# Altium schematic sheet F405.SchDoc
size A0
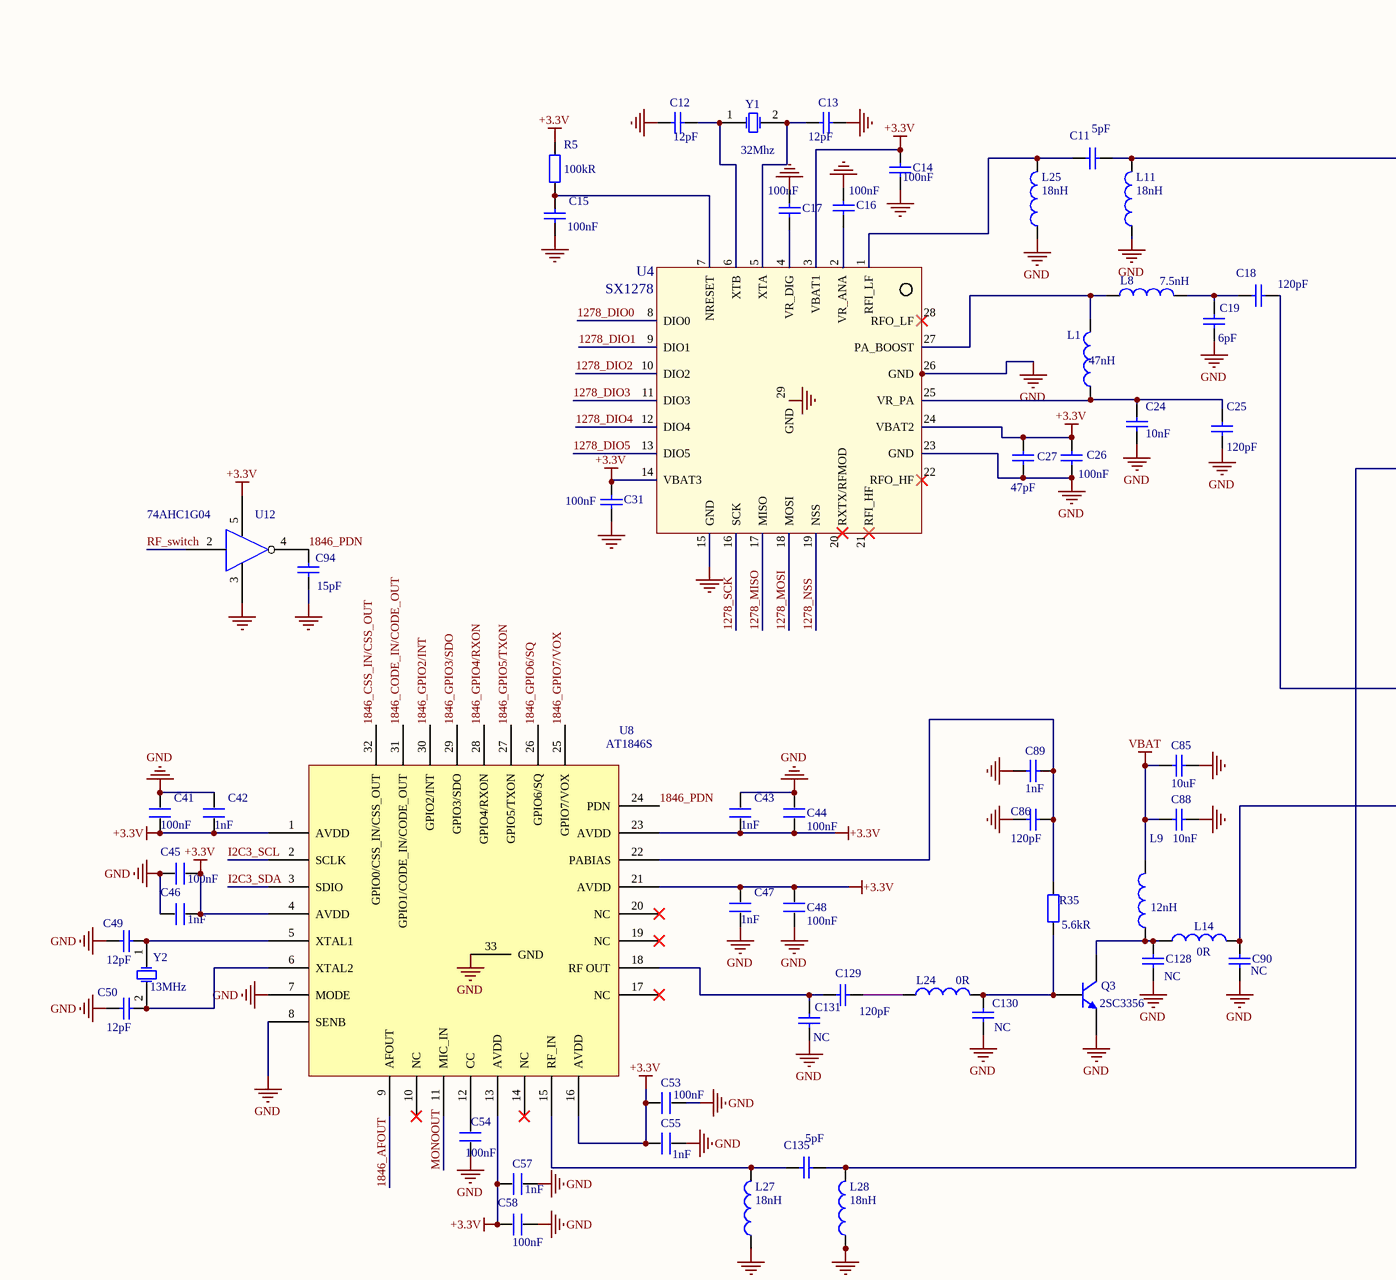
[diagram p0: F405.SchDoc, top left]
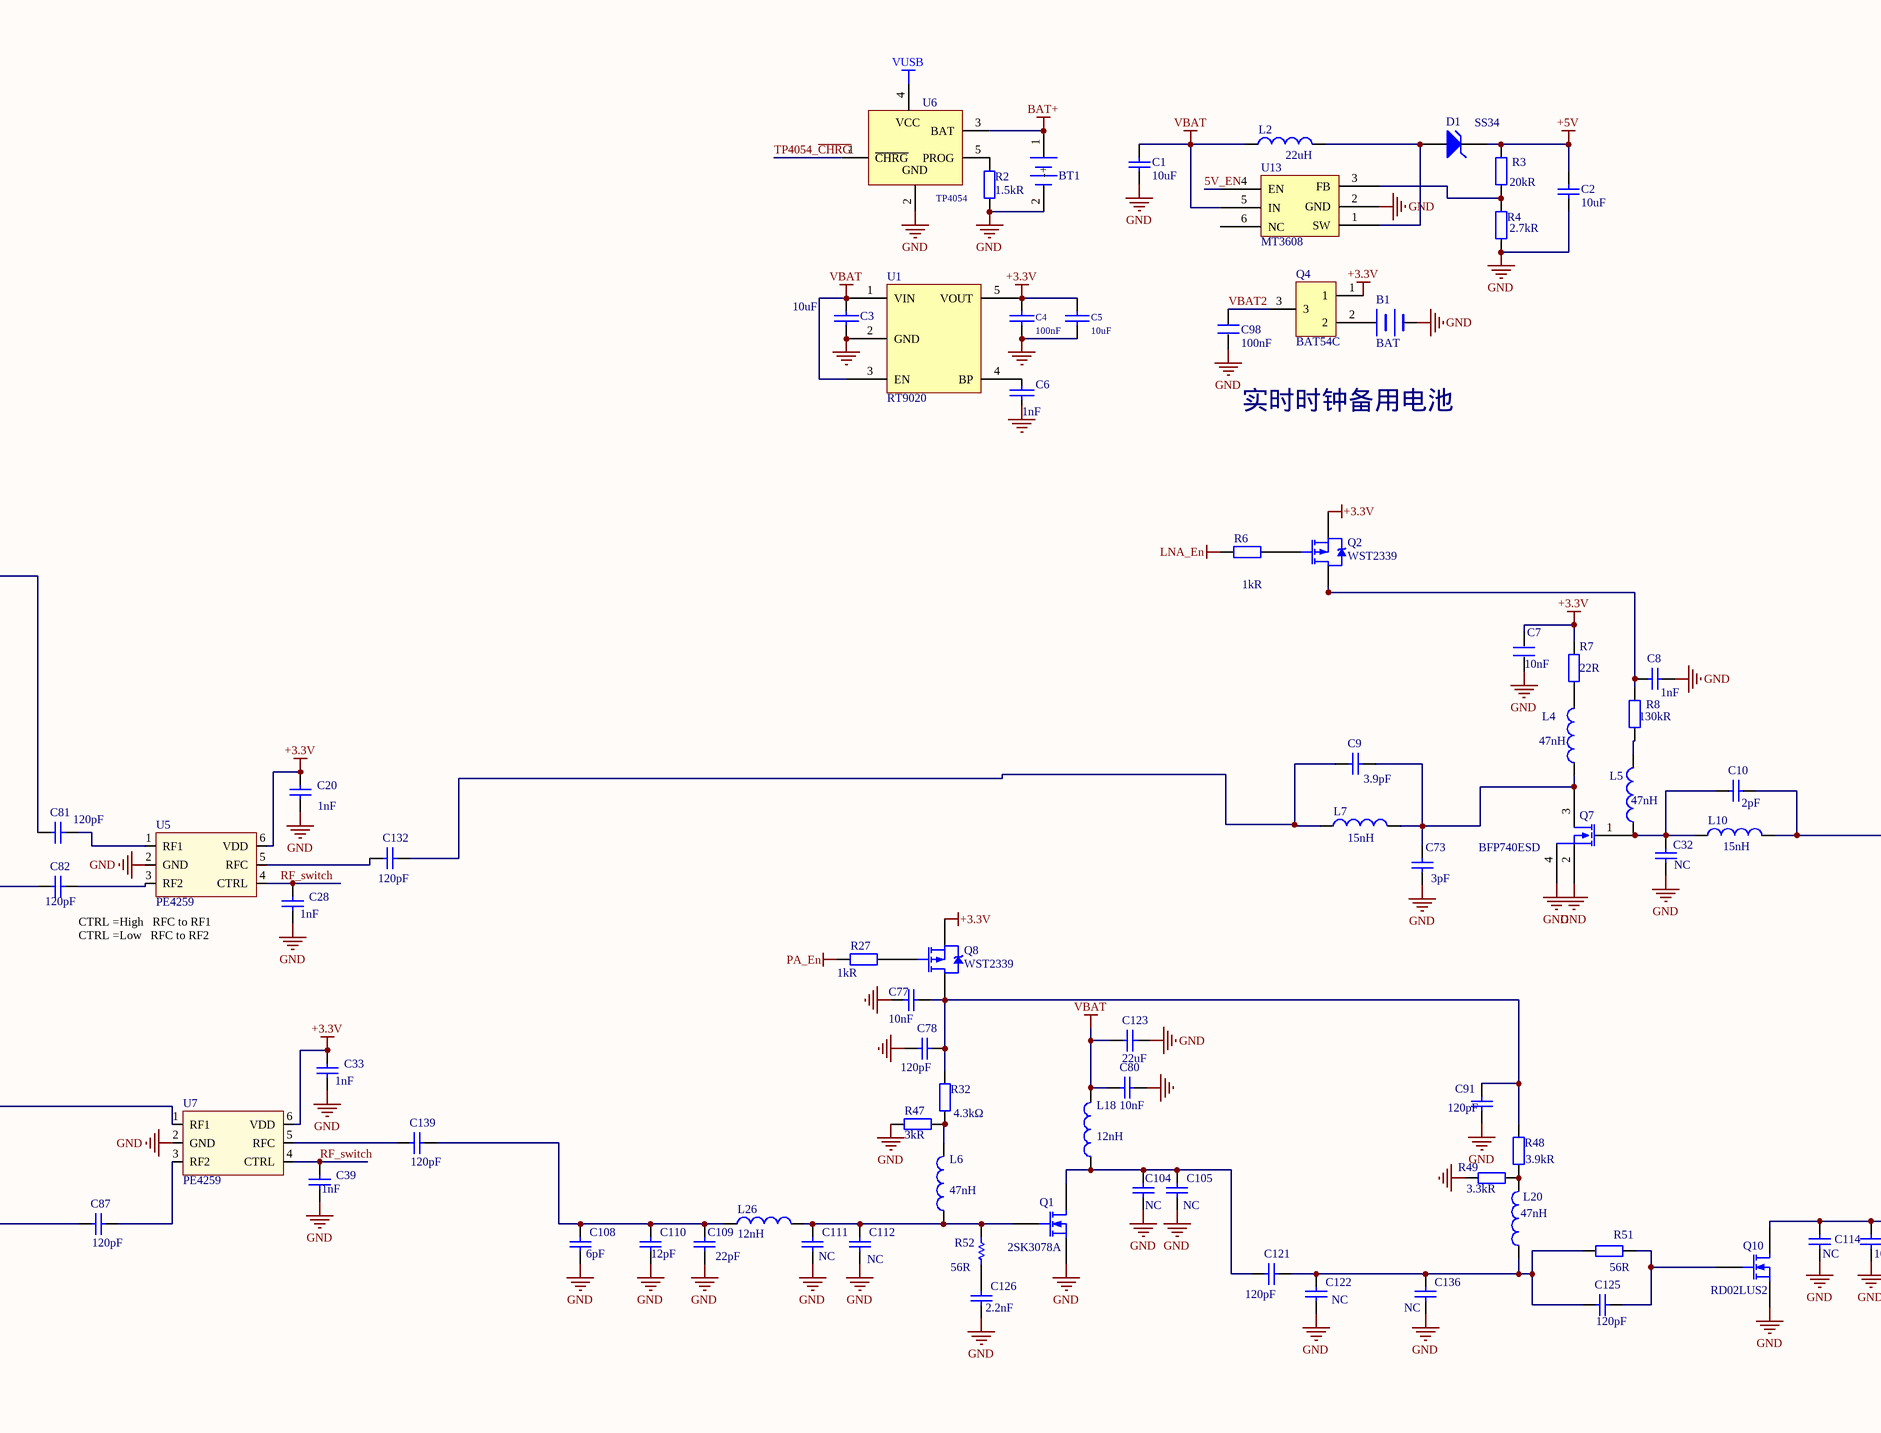
[diagram p1: F405.SchDoc, top middle]
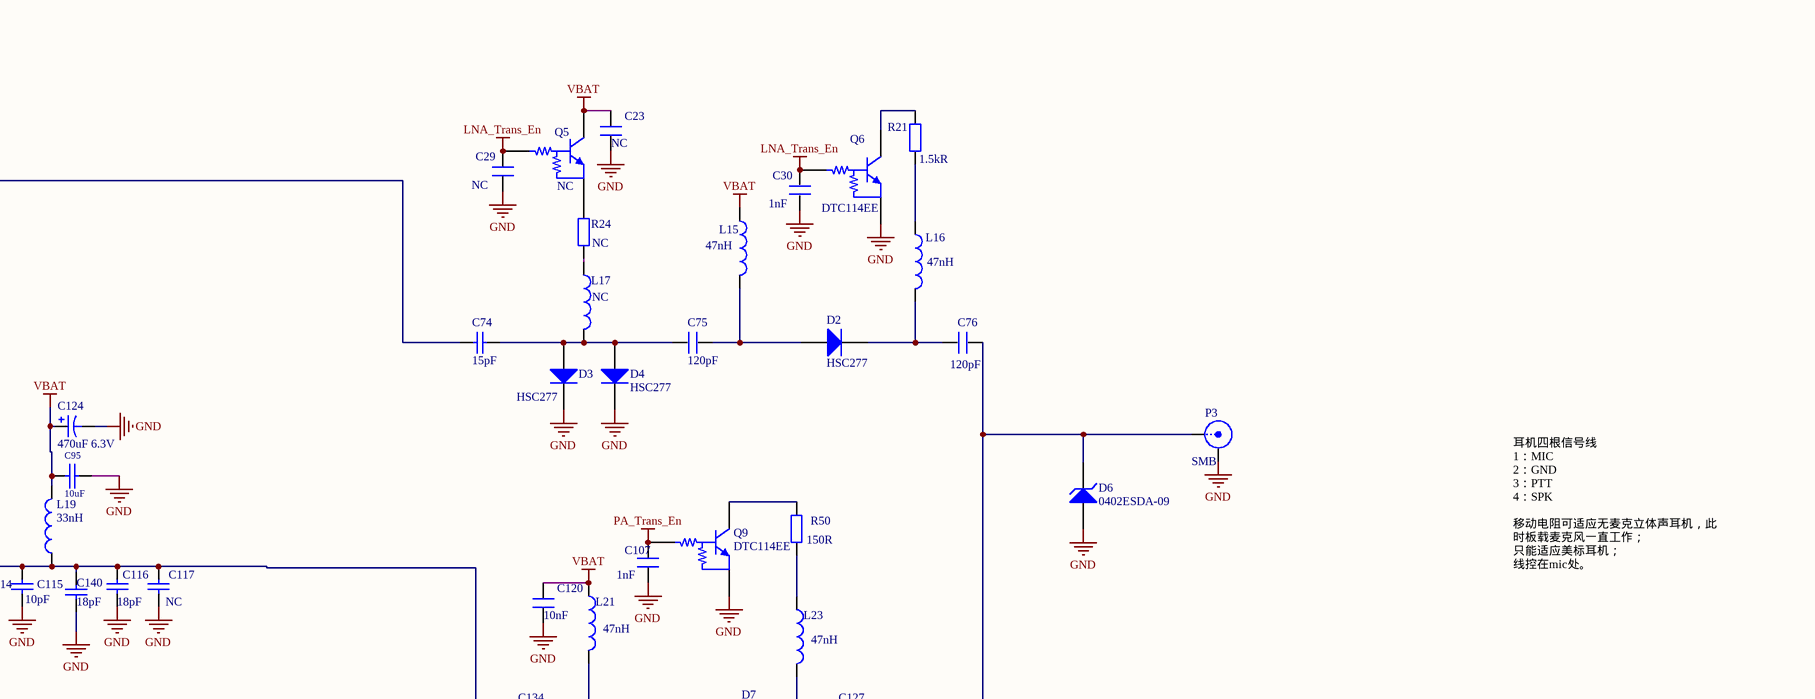
[diagram p2: F405.SchDoc, top right]
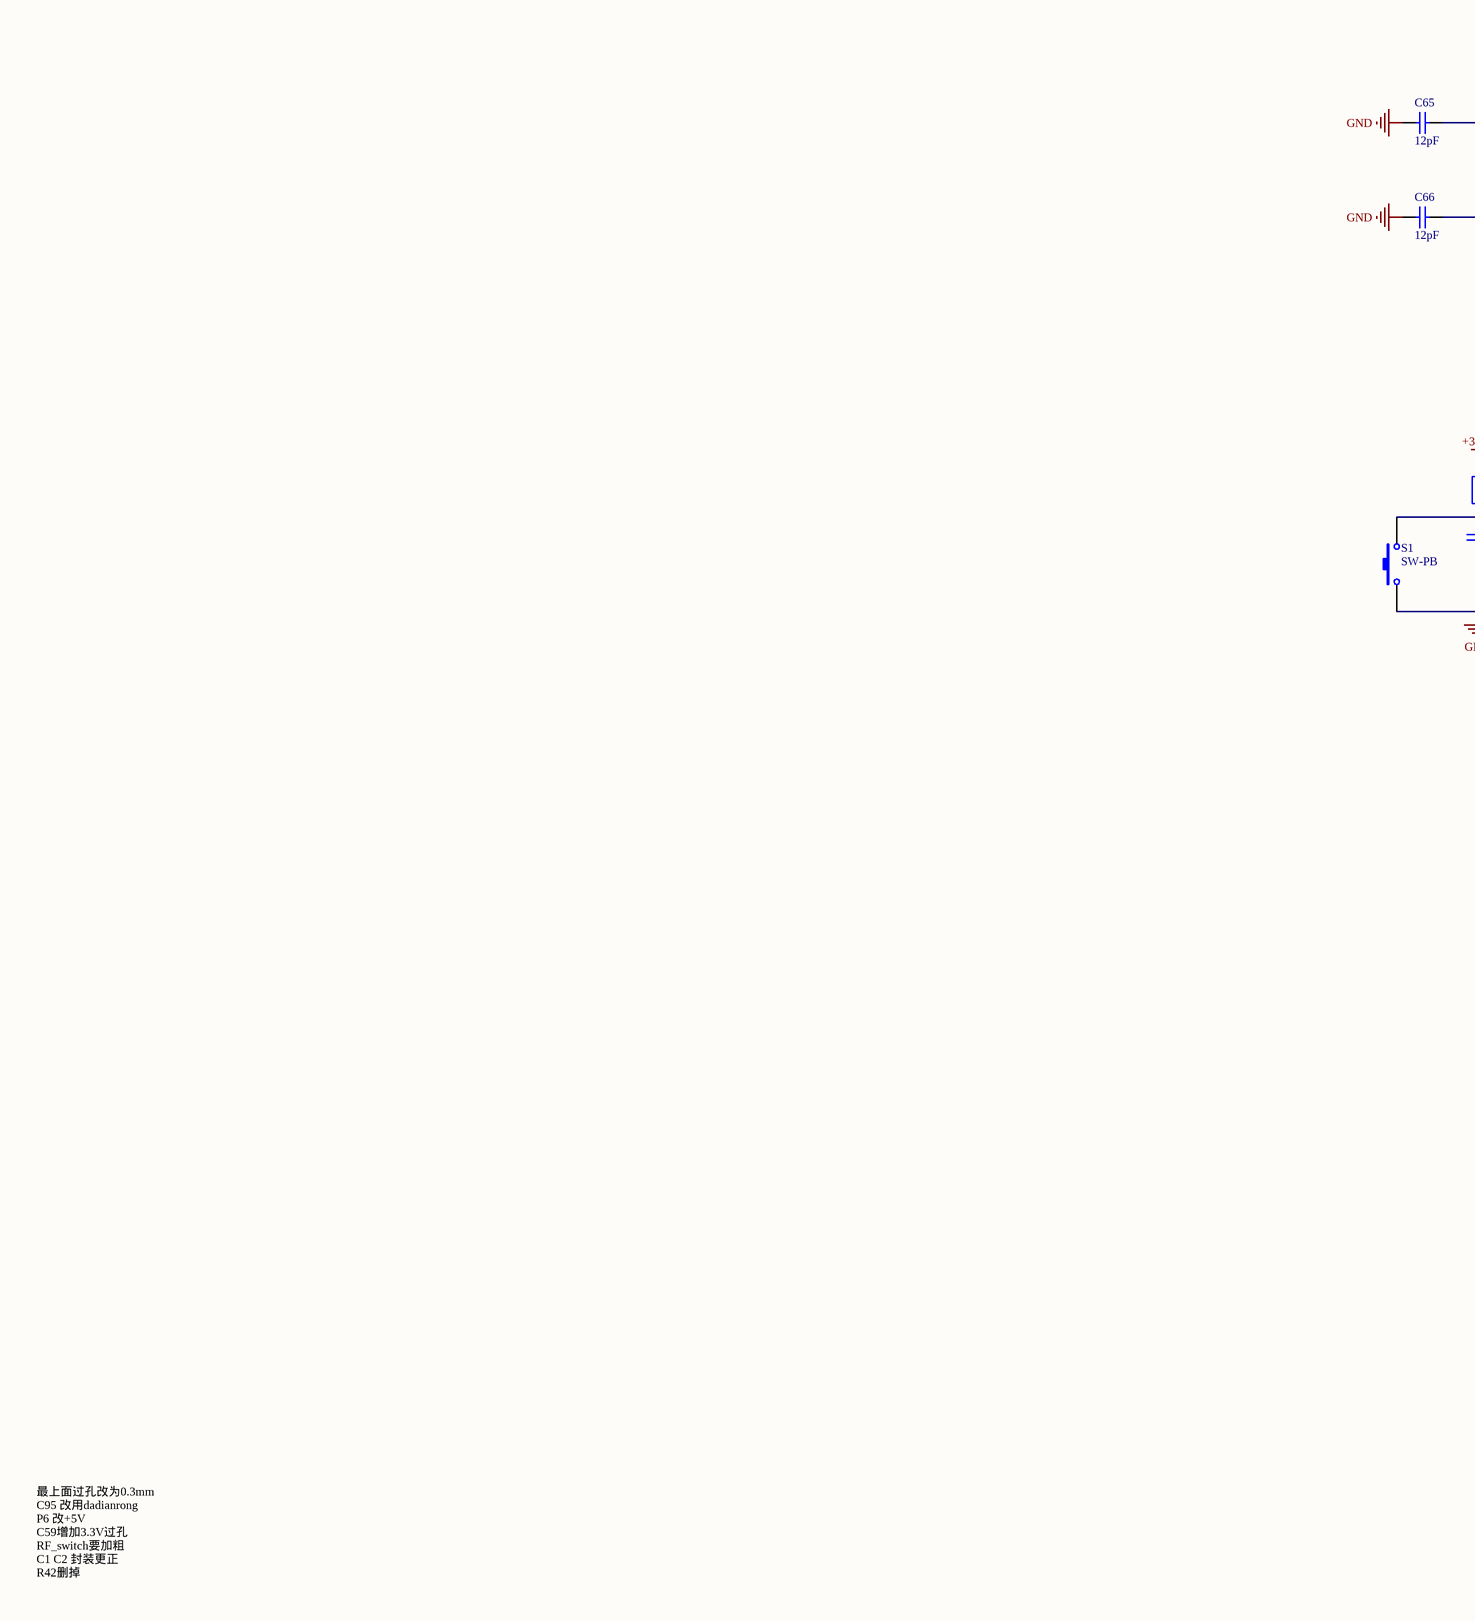
[diagram p3: F405.SchDoc, bottom left]
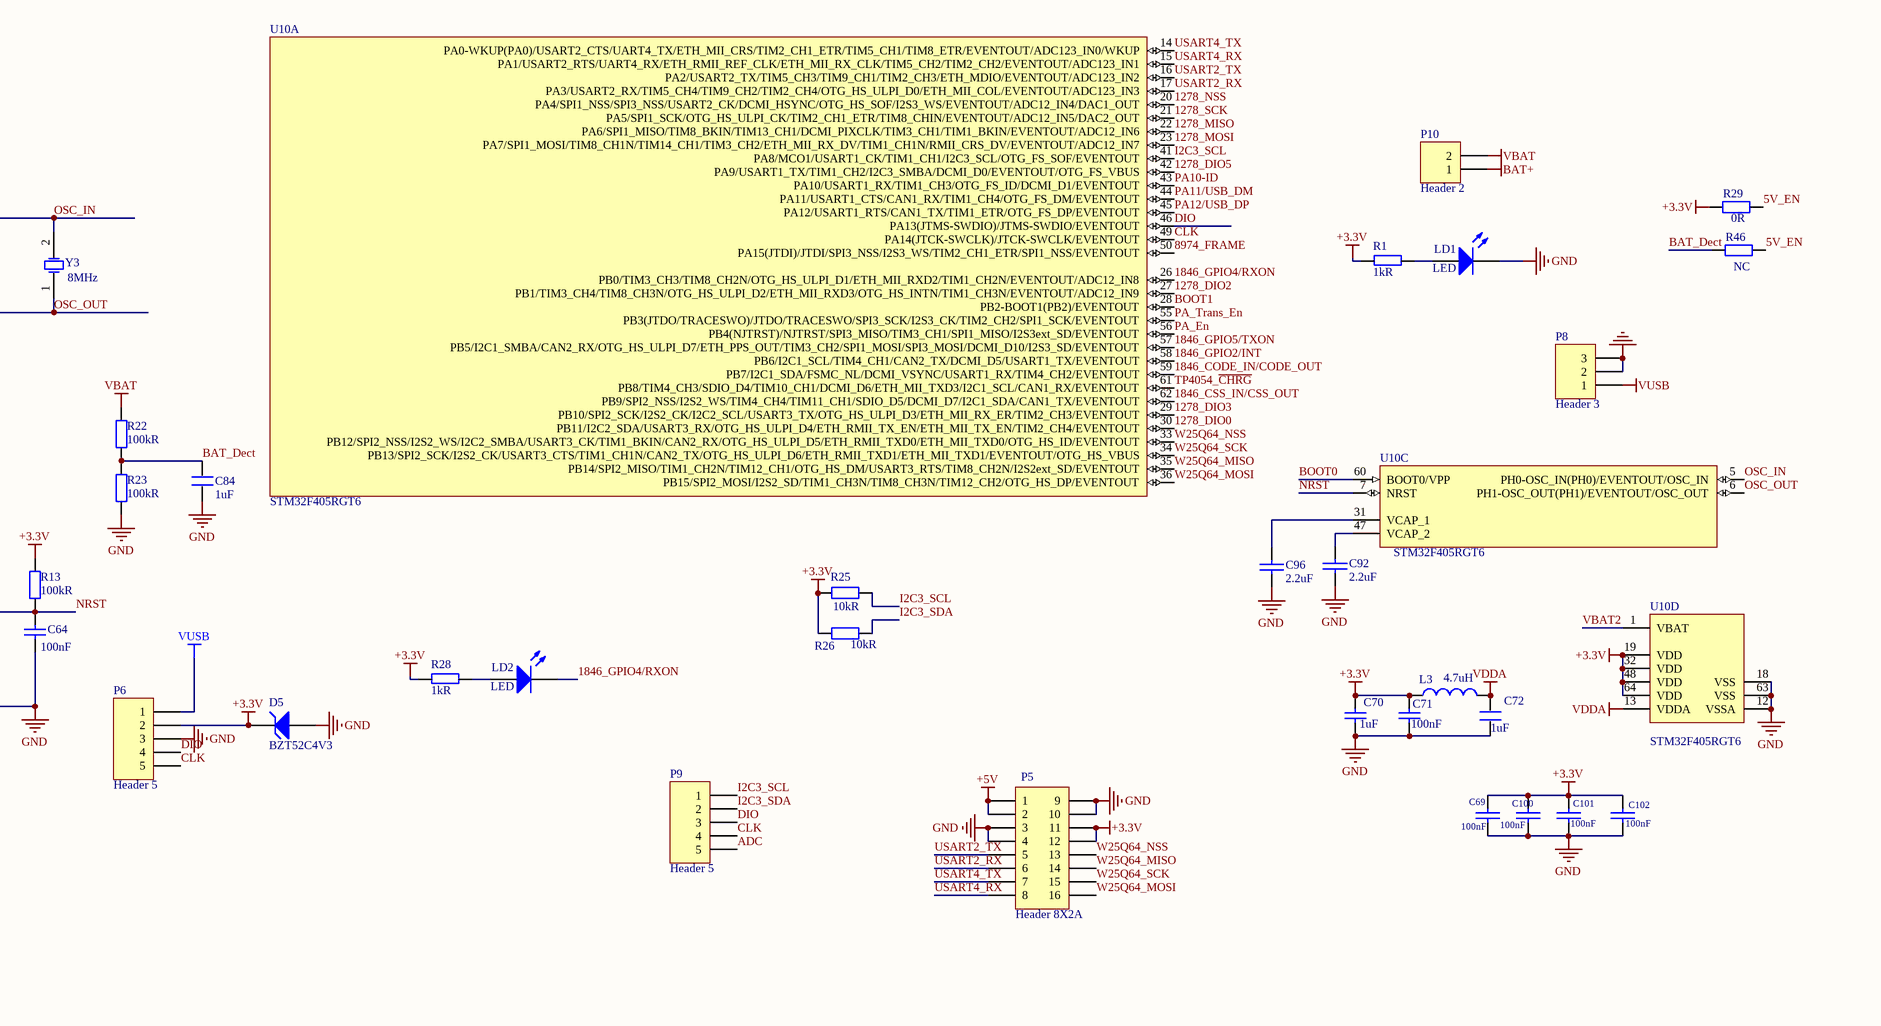
[diagram p4: F405.SchDoc, bottom middle]
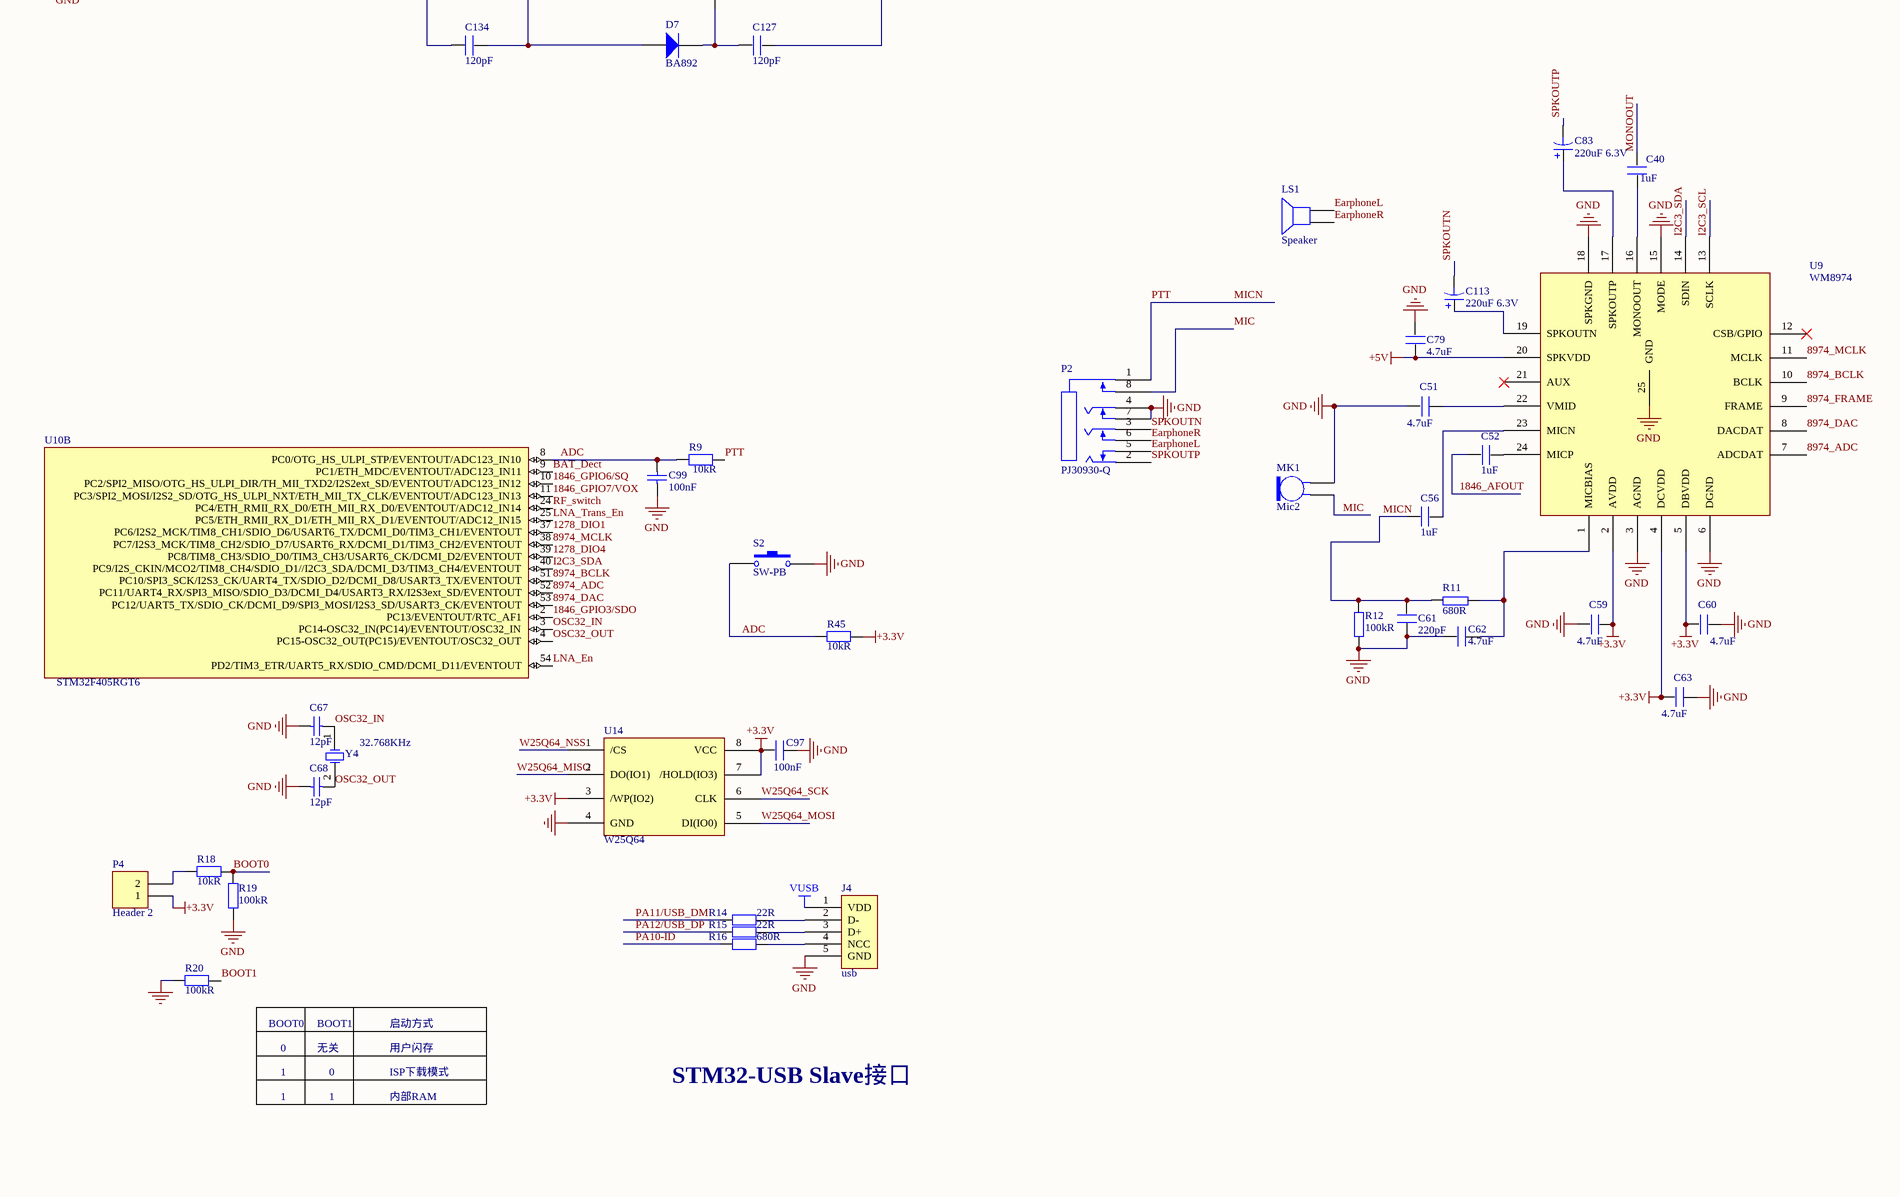
[diagram p5: F405.SchDoc, bottom right]

## Parts
B1  BAT  [HDR1X2]
BT1  纽扣电池座  [HDR1X2]  (value not drawn)
C1  10uF  [0603_C]
C2  10uF  [0603_C]
C3  10uF  [0402_C]
C4  100nF  [0402_C]
C5  10uF  [0402_C]
C6  1nF  [0402_C]
C7  10nF  [0402_C]
C8  1nF  [0402_C]
C9  3.9pF  [0402_C]
C10  2pF  [0402_C]
C11  5pF  [0402_C]
C12  12pF  [0402_C]
C13  12pF  [0402_C]
C14  100nF  [0402_C]
C15  100nF  [0402_C]
C16  100nF  [0402_C]
C17  100nF  [0402_C]
C18  120pF  [0402_C]
C19  6pF  [0402_C]
C20  1nF  [0402_C]
C23  NC  [0402_C]
C24  10nF  [0402_C]
C25  120pF  [0402_C]
C26  100nF  [0402_C]
C27  47pF  [0402_C]
C28  1nF  [0402_C]
C29  NC  [0402_C]
C30  1nF  [0402_C]
C31  100nF  [0402_C]
C32  NC  [0402_C]
C33  1nF  [0402_C]
C39  1nF  [0402_C]
C40  1uF  [0402_C]
C41  100nF  [0402_C]
C42  1nF  [0402_C]
C43  1nF  [0402_C]
C44  100nF  [0402_C]
C45  100nF  [0402_C]
C46  1nF  [0402_C]
C47  1nF  [0402_C]
C48  100nF  [0402_C]
C49  12pF  [0402_C]
C50  12pF  [0402_C]
C51  4.7uF  [0402_C]
C52  1uF  [0402_C]
C53  100nF  [0402_C]
C54  100nF  [0402_C]
C55  1nF  [0402_C]
C56  1uF  [0402_C]
C57  1nF  [0402_C]
C58  100nF  [0402_C]
C59  4.7uF  [0402_C]
C60  4.7uF  [0402_C]
C61  220pF  [0402_C]
C62  4.7uF  [0402_C]
C63  4.7uF  [0402_C]
C64  100nF  [0402_C]
C65  12pF  [0402_C]
C66  12pF  [0402_C]
C67  12pF  [0402_C]
C68  12pF  [0402_C]
C69  100nF  [0402_C]
C70  1uF  [0402_C]
C71  100nF  [0402_C]
C72  1uF  [0402_C]
C73  3pF  [0402_C]
C74  15pF  [0402_C]
C75  120pF  [0402_C]
C76  120pF  [0402_C]
C77  10nF  [0402_C]
C78  120pF  [0402_C]
C79  4.7uF  [0402_C]
C80  10nF  [0402_C]
C81  120pF  [0402_C]
C82  120pF  [0402_C]
C83  220uF 6.3V  [CASE-B_3528]
C84  1uF  [0402_C]
C85  10uF  [0402_C]
C86  120pF  [0402_C]
C87  120pF  [0402_C]
C88  10nF  [0402_C]
C89  1nF  [0402_C]
C90  NC  [0402_C]
C91  120pF  [0402_C]
C92  2.2uF  [0402_C]
C94  15pF  [0402_C]
C95  10uF  [0603_C]
C96  2.2uF  [0402_C]
C97  100nF  [0402_C]
C98  100nF  [0402_C]
C99  100nF  [0402_C]
C100  100nF  [0402_C]
C101  100nF  [0402_C]
C102  100nF  [0402_C]
C104  NC  [0402_C]
C105  NC  [0402_C]
C107  1nF  [0402_C]
C108  6pF  [0402_C]
C109  22pF  [0402_C]
C110  12pF  [0402_C]
C111  NC  [0402_C]
C112  NC  [0402_C]
C113  220uF 6.3V  [CASE-B_3528]
C114  NC  [0402_C]
C115  10pF  [0402_C]
C116  18pF  [0402_C]
C117  NC  [0402_C]
C120  10nF  [0402_C]
C121  120pF  [0402_C]
C122  NC  [0402_C]
C123  22uF  [0805_C]
C124  470uF 6.3V  [6.3x7.7]
C125  120pF  [0402_C]
C126  2.2nF  [0402_C]
C127  120pF  [0603_C]
C128  NC  [0402_C]
C129  120pF  [0402_C]
C130  NC  [0402_C]
C131  NC  [0402_C]
C132  120pF  [0402_C]
C134  120pF  [0603_C]
C135  5pF  [0402_C]
C136  NC  [0402_C]
C139  120pF  [0402_C]
C140  18pF  [0402_C]
D1  SS34  [SMA]
D2  HSC277  [SC-79]
D3  HSC277  [SC-79]
D4  HSC277  [SC-79]
D5  BZT52C4V3  [1206]
D6  0402ESDA-09  [TSLP-2-20]
D7  BA892  [LC-SOD-523]
J4  usb  [USB-MICRO]
L1  47nH  [0402_L]
L2  22uH  [SMNR4020-220M]
L3  4.7uH  [0603_L]
L4  47nH  [0402_L]
L5  47nH  [0402_L]
L6  47nH  [0402_L]
L7  15nH  [0402_L]
L8  7.5nH  [0402_L]
L9  12nH  [0603_L]
L10  15nH  [0402_L]
L11  18nH  [0402_L]
L14  0R  [0402_L]
L15  47nH  [0402_L]
L16  47nH  [0402_L]
L17  NC  [0402_L]
L18  12nH  [0805_L]
L19  value 33nH  [0908-12N]  (hidden comment: Inductor)
L20  47nH  [0402_L]
L21  47nH  [0402_L]
L23  47nH  [0402_L]
L24  0R  [0402_L]
L25  18nH  [0402_L]
L26  12nH  [0402_L]
L27  18nH  [0402_L]
L28  18nH  [0402_L]
LD1  LED  [0603_LED_S1]
LD2  LED  [0603_LED_S1]
LS1  Speaker  [PIN2]
MK1  Mic2  [4013_mic]
P2  PJ30930-Q  [PJ30930-Q]
P3  SMB  [SMB_V-RJ45]
P4  Header 2  [HDR1X2]
P5  Header 8X2A  [HDR2X8_CEN]
P6  Header 5  [HDR1X5]
P8  Header 3  [电源插座]
P9  Header 5  [HDR1X5]
P10  Header 2  [HDR1X2]
Q1  2SK3078A  [sot-89]
Q2  WST2339  [LC-SOT-23(SOT-23-3)]
Q3  2SC3356  [LC-SOT-23(SOT-23-3)]
Q4  BAT54C  [SOT-23-BAT54C]
Q5  NC  [LC-SC-75(SOT-523)]
Q6  DTC114EE  [LC-SC-75(SOT-523)]
Q7  BFP740ESD  [BFP740]
Q8  WST2339  [LC-SOT-23(SOT-23-3)]
Q9  DTC114EE  [LC-SC-75(SOT-523)]
Q10  RD02LUS2  [sot-89]
R1  1kR  [0402_R]
R2  1.5kR  [0402_R]
R3  20kR  [0402_R]
R4  2.7kR  [0402_R]
R5  100kR  [0402_R]
R6  1kR  [0402_R]
R7  22R  [0402_R]
R8  130kR  [0402_R]
R9  10kR  [0402_R]
R11  680R  [0402_R]
R12  100kR  [0402_R]
R13  100kR  [0402_R]
R14  22R  [0402_R]
R15  22R  [0402_R]
R16  680R  [0402_R]
R18  10kR  [0402_R]
R19  100kR  [0402_R]
R20  100kR  [0402_R]
R21  1.5kR  [0402_R]
R22  100kR  [0402_R]
R23  100kR  [0402_R]
R24  NC  [0402_R]
R25  10kR  [0402_R]
R26  10kR  [0402_R]
R27  1kR  [0402_R]
R28  1kR  [0402_R]
R29  0R  [0402_R]
R32  4.3kΩ  [0402_R]
R35  5.6kR  [0402_R]
R45  10kR  [0402_R]
R46  NC  [0402_R]
R47  3kR  [0402_R]
R48  3.9kR  [0402_R]
R49  3.3kR  [0402_R]
R50  150R  [0402_R]
R51  56R  [0402_R]
R52  56R  [0402_R]
S1  SW-PB  [SW-SPST]
S2  SW-PB  [SW-SPST]
U1  RT9020  [LC-SOT-23-5]
U4  SX1278  [SX1278]
U5  PE4259  [SC70-6]
U6  TP4054  [LC-SOT-23-5]
U7  PE4259  [SC70-6]
U8  AT1846S  [AT1846S]
U9  WM8974  [Wm8974]
U10  STM32F405RGT6  [TQFP64_L]  (parts A,B,C,D of 4)
U12  74AHC1G04  [LC-SOT-353]
U13  MT3608  [SOT23-6]
U14  W25Q64  [W25Q64]
Y1  32Mhz  [nd3225da - nd2520da]
Y2  13MHz  [nd3225da - nd2520da]
Y3  8MHz  [nd3225da - nd2520da]
Y4  32.768KHz  [3215]

## Nets
+3.3V: C4.1 C5.1 C7.1 C14.1 C20.2 C26.2 C27.2 C31.1 C33.2 C41.2 C42.2 C43.2 C44.1 C45.2 C46.2 C47.1 C48.2 C53.1 C55.1 C57.1 C58.1 C59.1 C60.2 C63.2 C69.1 C70.1 C71.1 C97.2 C100.1 C101.1 C102.1 D5.2(K) L3.1 P4.1 P5.11 P5.12 P6.2 Q2.3(S) Q4.1 Q8.3(S) R1.2 R5.2 R7.2 R13.2 R25.2 R26.2 R28.2 R29.2 R45.2 U1.5(VOUT) U4.3(VBAT1) U4.14(VBAT3) U4.24(VBAT2) U5.6(VDD) U7.6(VDD) U8.1(AVDD) U8.4(AVDD) U8.13(AVDD) U8.16(AVDD) U8.21(AVDD) U8.23(AVDD) U9.2(AVDD) U9.4(DCVDD) U9.5(DBVDD) U10.19(VDD) U10.32(VDD) U10.48(VDD) U10.64(VDD) U12.5(VCC) U14.3(/WP(IO2)) U14.7(/HOLD(IO3)) U14.8(VCC)
+5V: C2.2 C79.2 D1.2(K) P5.1 P5.2 R3.2 U9.20(SPKVDD)
BAT+: BT1.1(+) P10.1 U6.3(BAT)
GND: B1.2 BT1.2(-) C1.1 C2.1 C3.1 C4.2 C5.2 C6.2 C7.2 C8.1 C12.2 C13.1 C14.2 C15.1 C16.1 C17.1 C19.1 C20.1 C23.1 C24.1 C25.1 C26.1 C27.1 C28.1 C29.2 C30.2 C31.2 C32.2 C33.1 C39.1 C41.1 C42.1 C43.1 C44.2 C45.1 C46.1 C47.2 C48.1 C49.1 C50.1 C51.2 C53.2 C54.1 C55.2 C57.2 C58.2 C59.2 C60.1 C61.2 C62.2 C63.1 C64.1 C65.1 C66.1 C67.1 C68.1 C69.2 C70.2 C71.2 C72.1 C73.2 C77.1 C78.1 C79.1 C80.1 C84.2 C85.1 C86.1 C88.1 C89.1 C90.1 C91.1 C92.1 C94.2 C95.2 C96.1 C97.1 C98.2 C99.1 C100.2 C101.2 C102.2 C104.1 C105.1 C107.2 C108.1 C109.1 C110.1 C111.1 C112.1 C114.1 C115.1 C116.1 C117.1 C120.1 C122.1 C123.1 C124.2 C126.1 C128.1 C130.1 C131.1 C136.1 C140.1 D3.2(K) D4.2(K) D5.1(A) D6.1(A) J4.5(GND) L11.1 L25.1 L27.1 L28.1 LD1.2(K) MK1.2 P2.4 P2.7 P3.2(Y) P5.3 P5.4 P5.9 P5.10 P6.3 P8.2 P8.3 Q1.3(S) Q3.3(E) Q6.2(E) Q7.2 Q7.4 Q9.2(E) Q10.3(S) R2.2 R4.1 R12.1 R19.1 R20.1 R23.1 R47.1 R49.2 S1.1 S2.2 U1.2(GND) U4.15(GND) U4.23(GND) U4.26(GND) U4.29(GND) U5.2(GND) U6.2(GND) U7.2(GND) U8.7(MODE) U8.8(SENB) U8.33(GND) U9.3(AGND) U9.6(DGND) U9.15(MODE) U9.18(SPKGND) U9.25(GND) U10.12(VSSA) U10.18(VSS) U10.63(VSS) U12.3(GND) U13.2(GND) U14.4(GND)
LNA_En: R6.2 U10.54(PD2/TIM3_ETR/UART5_RX/SDIO_CMD/DCMI_D11/EVENTOUT)
LNA_Trans_En: C29.1 C30.1 Q5.1(B) Q6.1(B) U10.25(PC5/ETH_RMII_RX_D1/ETH_MII_RX_D1/EVENTOUT/ADC12_IN15)
PA_En: R27.2 U10.56(PB4(NJTRST)/NJTRST/SPI3_MISO/TIM3_CH1/SPI1_MISO/I2S3ext_SD/EVENTOUT)
PA_Trans_En: C107.1 Q9.1(B) U10.55(PB3(JTDO/TRACESWO)/JTDO/TRACESWO/SPI3_SCK/I2S3_CK/TIM2_CH2/SPI1_SCK/EVENTOUT)
VBAT: C1.2 C3.2 C23.2 C80.2 C85.2 C88.2 C95.1 C120.2 C123.2 C124.1 L2.1 L9.2 L15.1 L18.2 L19.2 L21.1 P10.2 Q5.3(C) R22.2 U1.1(VIN) U1.3(EN) U13.5(IN)
VDDA: C72.2 L3.2 U10.13(VDDA)
VUSB: J4.1(VDD) P6.1 P8.1 U6.4(VCC)
5V_EN: R29.1 R46.1 U13.4(EN)
1278_DIO0: U4.8(DIO0) U10.30(PB11/I2C2_SDA/USART3_RX/OTG_HS_ULPI_D4/ETH_RMII_TX_EN/ETH_MII_TX_EN/TIM2_CH4/EVENTOUT)
1278_DIO1: U4.9(DIO1) U10.37(PC6/I2S2_MCK/TIM8_CH1/SDIO_D6/USART6_TX/DCMI_D0/TIM3_CH1/EVENTOUT)
1278_DIO2: U4.10(DIO2) U10.27(PB1/TIM3_CH4/TIM8_CH3N/OTG_HS_ULPI_D2/ETH_MII_RXD3/OTG_HS_INTN/TIM1_CH3N/EVENTOUT/ADC12_IN9)
1278_DIO3: U4.11(DIO3) U10.29(PB10/SPI2_SCK/I2S2_CK/I2C2_SCL/USART3_TX/OTG_HS_ULPI_D3/ETH_MII_RX_ER/TIM2_CH3/EVENTOUT)
1278_DIO4: U4.12(DIO4) U10.39(PC8/TIM8_CH3/SDIO_D0/TIM3_CH3/USART6_CK/DCMI_D2/EVENTOUT)
1278_DIO5: U4.13(DIO5) U10.42(PA9/USART1_TX/TIM1_CH2/I2C3_SMBA/DCMI_D0/EVENTOUT/OTG_FS_VBUS)
1278_MISO: U4.17(MISO) U10.22(PA6/SPI1_MISO/TIM8_BKIN/TIM13_CH1/DCMI_PIXCLK/TIM3_CH1/TIM1_BKIN/EVENTOUT/ADC12_IN6)
1278_MOSI: U4.18(MOSI) U10.23(PA7/SPI1_MOSI/TIM8_CH1N/TIM14_CH1/TIM3_CH2/ETH_MII_RX_DV/TIM1_CH1N/RMII_CRS_DV/EVENTOUT/ADC12_IN7)
1278_NSS: U4.19(NSS) U10.20(PA4/SPI1_NSS/SPI3_NSS/USART2_CK/DCMI_HSYNC/OTG_HS_SOF/I2S3_WS/EVENTOUT/ADC12_IN4/DAC1_OUT)
1278_SCK: U4.16(SCK) U10.21(PA5/SPI1_SCK/OTG_HS_ULPI_CK/TIM2_CH1_ETR/TIM8_CHIN/EVENTOUT/ADC12_IN5/DAC2_OUT)
1846_AFOUT: C52.2 U8.9(AFOUT)
1846_CODE_IN/CODE_OUT: U8.31(GPIO1/CODE_IN/CODE_OUT) U10.59(PB7/I2C1_SDA/FSMC_NL/DCMI_VSYNC/USART1_RX/TIM4_CH2/EVENTOUT)
1846_CSS_IN/CSS_OUT: U8.32(GPIO0/CSS_IN/CSS_OUT) U10.62(PB9/SPI2_NSS/I2S2_WS/TIM4_CH4/TIM11_CH1/SDIO_D5/DCMI_D7/I2C1_SDA/CAN1_TX/EVENTOUT)
1846_GPIO2/INT: U8.30(GPIO2/INT) U10.58(PB6/I2C1_SCL/TIM4_CH1/CAN2_TX/DCMI_D5/USART1_TX/EVENTOUT)
1846_GPIO3/SDO: U8.29(GPIO3/SDO) U10.2(PC13/EVENTOUT/RTC_AF1)
1846_GPIO4/RXON: LD2.2(K) U8.28(GPIO4/RXON) U10.26(PB0/TIM3_CH3/TIM8_CH2N/OTG_HS_ULPI_D1/ETH_MII_RXD2/TIM1_CH2N/EVENTOUT/ADC12_IN8)
1846_GPIO5/TXON: U8.27(GPIO5/TXON) U10.57(PB5/I2C1_SMBA/CAN2_RX/OTG_HS_ULPI_D7/ETH_PPS_OUT/TIM3_CH2/SPI1_MOSI/SPI3_MOSI/DCMI_D10/I2S3_SD/EVENTOUT)
1846_GPIO6/SQ: U8.26(GPIO6/SQ) U10.10(PC2/SPI2_MISO/OTG_HS_ULPI_DIR/TH_MII_TXD2/I2S2ext_SD/EVENTOUT/ADC123_IN12)
1846_GPIO7/VOX: U8.25(GPIO7/VOX) U10.11(PC3/SPI2_MOSI/I2S2_SD/OTG_HS_ULPI_NXT/ETH_MII_TX_CLK/EVENTOUT/ADC123_IN13)
1846_PDN: C94.1 U8.24(PDN) U12.4(Y)
8974_ADC: U9.7(ADCDAT) U10.52(PC11/UART4_RX/SPI3_MISO/SDIO_D3/DCMI_D4/USART3_RX/I2S3ext_SD/EVENTOUT)
8974_BCLK: U9.10(BCLK) U10.51(PC10/SPI3_SCK/I2S3_CK/UART4_TX/SDIO_D2/DCMI_D8/USART3_TX/EVENTOUT)
8974_DAC: U9.8(DACDAT) U10.53(PC12/UART5_TX/SDIO_CK/DCMI_D9/SPI3_MOSI/I2S3_SD/USART3_CK/EVENTOUT)
8974_FRAME: U9.9(FRAME) U10.50(PA15(JTDI)/JTDI/SPI3_NSS/I2S3_WS/TIM2_CH1_ETR/SPI1_NSS/EVENTOUT)
8974_MCLK: U9.11(MCLK) U10.38(PC7/I2S3_MCK/TIM8_CH2/SDIO_D7/USART6_RX/DCMI_D1/TIM3_CH2/EVENTOUT)
ADC: C99.2 P9.5 R9.2 R45.1 S2.1 U10.8(PC0/OTG_HS_ULPI_STP/EVENTOUT/ADC123_IN10)
BAT_Dect: C84.1 R22.1 R23.2 R46.2 U10.9(PC1/ETH_MDC/EVENTOUT/ADC123_IN11)
BOOT0: R18.2 R19.2 U10.60(BOOT0/VPP)
BOOT1: R20.2 U10.28(PB2-BOOT1(PB2)/EVENTOUT)
CLK: P6.5 P9.4 U10.49(PA14(JTCK-SWCLK)/JTCK-SWCLK/EVENTOUT)
DIO: P6.4 P9.3 U10.46(PA13(JTMS-SWDIO)/JTMS-SWDIO/EVENTOUT)
EarphoneL: LS1.2 P2.5
EarphoneR: LS1.1 P2.6
I2C3_SCL: P9.1 R25.1 U8.2(SCLK) U9.13(SCLK) U10.41(PA8/MCO1/USART1_CK/TIM1_CH1/I2C3_SCL/OTG_FS_SOF/EVENTOUT)
I2C3_SDA: P9.2 R26.1 U8.3(SDIO) U9.14(SDIN) U10.40(PC9/I2S_CKIN/MCO2/TIM8_CH4/SDIO_D1//I2C3_SDA/DCMI_D3/TIM3_CH4/EVENTOUT)
MIC: MK1.1 P2.8
MICN: C56.1 C61.1 P2.1 R9.1 R11.1 R12.2  [also labelled PTT]
MONOOUT: C40.1 U8.11(MIC_IN)
NRST: C64.2 R13.1 S1.2 U10.7(NRST)
OSC32_IN: C67.2 U10.3(PC14-OSC32_IN(PC14)/EVENTOUT/OSC32_IN) Y4.1(OSC1)
OSC32_OUT: C68.2 U10.4(PC15-OSC32_OUT(PC15)/EVENTOUT/OSC32_OUT) Y4.2(OSC2)
OSC_IN: C65.2 U10.5(PH0-OSC_IN(PH0)/EVENTOUT/OSC_IN) Y3.2(OSC2)
OSC_OUT: C66.2 U10.6(PH1-OSC_OUT(PH1)/EVENTOUT/OSC_OUT) Y3.1(OSC1)
PA10-ID: R16.1 U10.43(PA10/USART1_RX/TIM1_CH3/OTG_FS_ID/DCMI_D1/EVENTOUT)
PA11/USB_DM: R14.1 U10.44(PA11/USART1_CTS/CAN1_RX/TIM1_CH4/OTG_FS_DM/EVENTOUT)
PA12/USB_DP: R15.1 U10.45(PA12/USART1_RTS/CAN1_TX/TIM1_ETR/OTG_FS_DP/EVENTOUT)
RF_switch: C28.2 C39.2 U5.4(CTRL) U7.4(CTRL) U10.24(PC4/ETH_RMII_RX_D0/ETH_MII_RX_D0/EVENTOUT/ADC12_IN14) U12.2(A)
SPKOUTN: C113.2 P2.3
SPKOUTP: C83.2 P2.2
TP4054_~{CHRG}: U6.1(~{CHRG}) U10.61(PB8/TIM4_CH3/SDIO_D4/TIM10_CH1/DCMI_D6/ETH_MII_TXD3/I2C1_SCL/CAN1_RX/EVENTOUT)
USART2_RX: P5.6 U10.17(PA3/USART2_RX/TIM5_CH4/TIM9_CH2/TIM2_CH4/OTG_HS_ULPI_D0/ETH_MII_COL/EVENTOUT/ADC123_IN3)
USART2_TX: P5.5 U10.16(PA2/USART2_TX/TIM5_CH3/TIM9_CH1/TIM2_CH3/ETH_MDIO/EVENTOUT/ADC123_IN2)
USART4_RX: P5.8 U10.15(PA1/USART2_RTS/UART4_RX/ETH_RMII_REF_CLK/ETH_MII_RX_CLK/TIM5_CH2/TIM2_CH2/EVENTOUT/ADC123_IN1)
USART4_TX: P5.7 U10.14(PA0-WKUP(PA0)/USART2_CTS/UART4_TX/ETH_MII_CRS/TIM2_CH1_ETR/TIM5_CH1/TIM8_ETR/EVENTOUT/ADC123_IN0/WKUP)
VBAT2: C98.1 Q4.3 U10.1(VBAT)
W25Q64_MISO: P5.14 U10.35(PB14/SPI2_MISO/TIM1_CH2N/TIM12_CH1/OTG_HS_DM/USART3_RTS/TIM8_CH2N/I2S2ext_SD/EVENTOUT) U14.2(DO(IO1))
W25Q64_MOSI: P5.16 U10.36(PB15/SPI2_MOSI/I2S2_SD/TIM1_CH3N/TIM8_CH3N/TIM12_CH2/OTG_HS_DP/EVENTOUT) U14.5(DI(IO0))
W25Q64_NSS: P5.13 U10.33(PB12/SPI2_NSS/I2S2_WS/I2C2_SMBA/USART3_CK/TIM1_BKIN/CAN2_RX/OTG_HS_ULPI_D5/ETH_RMII_TXD0/ETH_MII_TXD0/OTG_HS_ID/EVENTOUT) U14.1(/CS)
W25Q64_SCK: P5.15 U10.34(PB13/SPI2_SCK/I2S2_CK/USART3_CTS/TIM1_CH1N/CAN2_TX/OTG_HS_ULPI_D6/ETH_RMII_TXD1/ETH_MII_TXD1/EVENTOUT/OTG_HS_VBUS) U14.6(CLK)
NetB1_1: B1.1 Q4.2
NetC6_1: C6.1 U1.4(BP)
NetC8_2: C8.2 Q2.2(D) R8.2
NetC9_1: C9.1 C132.2 L7.1
NetC9_2: C9.2 C73.1 L4.1 L7.2 Q7.3
NetC10_1: C10.1 C32.1 L5.1 L10.1 Q7.1
NetC10_2: C10.2 C74.1 L10.2
NetC11_1: C11.1 C81.1 L11.2
NetC11_2: C11.2 L25.2 U4.1(RFI_LF)
NetC12_1: C12.1 U4.6(XTB) Y1.1(OSC1)
NetC13_2: C13.2 U4.5(XTA) Y1.2(OSC2)
NetC15_2: C15.2 R5.1 U4.7(NRESET)
NetC16_2: C16.2 U4.2(VR_ANA)
NetC17_2: C17.2 U4.4(VR_DIG)
NetC18_1: C18.1 U7.1(RF1)
NetC18_2: C18.2 C19.2 L8.2
NetC24_2: C24.2 C25.2 L1.1 U4.25(VR_PA)
NetC40_2: C40.2 U9.16(MONOOUT)
NetC49_2: C49.2 U8.5(XTAL1) Y2.1(OSC1)
NetC50_2: C50.2 U8.6(XTAL2) Y2.2(OSC2)
NetC51_1: C51.1 U9.22(VMID)
NetC52_1: C52.1 U9.24(MICP)
NetC54_2: C54.2 U8.12(CC)
NetC56_2: C56.2 U9.23(MICN)
NetC62_1: C62.1 R11.2 U9.1(MICBIAS)
NetC74_2: C74.2 C75.1 D3.1(A) D4.1(A) L17.2
NetC75_2: C75.2 D2.1(A) L15.2
NetC76_1: C76.1 D2.2(K) L16.2
NetC76_2: C76.2 C127.2 D6.2(K) P3.1(X)
NetC77_2: C77.2 C78.2 C91.2 Q8.2(D) R32.1 R48.1
NetC81_2: C81.2 U5.1(RF1)
NetC82_1: C82.1 C135.1 L28.2
NetC82_2: C82.2 U5.3(RF2)
NetC83_1: C83.1 U9.17(SPKOUTP)
NetC86_2: C86.2 C89.2 R35.1 U8.22(PABIAS)
NetC87_1: C87.1 U7.3(RF2)
NetC87_2: C87.2 C90.2 L14.2
NetC92_2: C92.2 U10.47(VCAP_2)
NetC96_2: C96.2 U10.31(VCAP_1)
NetC104_2: C104.2 C105.2 C121.1 L18.1 Q1.1(D)
NetC108_2: C108.2 C109.2 C110.2 C139.1 L26.1
NetC111_2: C111.2 C112.2 L6.1 L26.2 Q1.2(G) R52.2
NetC113_1: C113.1 U9.19(SPKOUTN)
NetC114_2: C114.2 C115.2 C116.2 C117.2 C134.1 C140.2 L19.1 Q10.1(D)
NetC121_2: C121.2 C122.2 C125.2 C136.2 L20.1 R51.2
NetC125_1: C125.1 Q10.2(G) R51.1
NetC126_2: C126.2 R52.1
NetC127_1: C127.1 D7.1(K) L23.2
NetC128_2: C128.2 L9.1 L14.1 Q3.1(C)
NetC129_1: C129.1 L24.1
NetC129_2: C129.2 C131.2 U8.18(RF_OUT)
NetC130_2: C130.2 L24.2 Q3.2(B) R35.2
NetC132_1: C132.1 U5.5(RFC)
NetC134_2: C134.2 D7.2(A) L21.2
NetC135_2: C135.2 L27.2 U8.15(RF_IN)
NetC139_2: C139.2 U7.5(RFC)
NetD1_1: D1.1(A) L2.2 U13.1(SW)
NetJ4_2: J4.2(D-) R14.2
NetJ4_3: J4.3(D+) R15.2
NetJ4_4: J4.4(NCC) R16.2
NetL1_2: L1.2 L8.1 U4.27(PA_BOOST)
NetL4_2: L4.2 R7.1
NetL5_2: L5.2 R8.1
NetL6_2: L6.2 R32.2 R47.2
NetL16_1: L16.1 R21.1
NetL17_1: L17.1 R24.1
NetL20_2: L20.2 R48.2 R49.1
NetL23_1: L23.1 R50.1
NetLD1_1: LD1.1(A) R1.1
NetLD2_1: LD2.1(A) R28.1
NetP4_2: P4.2 R18.1
NetQ2_1: Q2.1(G) R6.1
NetQ5_2: Q5.2(E) R24.2
NetQ6_3: Q6.3(C) R21.2
NetQ8_1: Q8.1(G) R27.1
NetQ9_3: Q9.3(C) R50.2
NetR2_1: R2.1 U6.5(PROG)
NetR3_1: R3.1 R4.2 U13.3(FB)

Not connected (* = marked no-connect by the designer): U4 20(RXTX/RFMOD)* 21(RFI_HF)* 22(RFO_HF)* 28(RFO_LF)*; U8 10(NC)* 14(NC)* 17(NC)* 19(NC)* 20(NC)*; U9 12(CSB/GPIO)* 21(AUX)*; U13 6(NC)

## Notes on the sheet
- 实时时钟备用电池
- CTRL =High   RFC to RF1
  CTRL =Low   RFC to RF2
- 耳机四根信号线
  1：MIC
  2：GND
  3：PTT
  4：SPK
  移动电阻可适应无麦克立体声耳机，此时板载麦克风一直工作；
  只能适应美标耳机；
  线控在mic处。
- BOOT0
- 0
- BOOT1
- 无关
- 启动方式
- 用户闪存
- 1
- ISP下载模式
- 内部RAM
- STM32-USB Slave接口
- 最上面过孔改为0.3mm
  C95 改用dadianrong
  P6 改+5V
  C59增加3.3V过孔
  RF_switch要加粗
  C1 C2 封装更正
  R42删掉

## Library data of the parts
B1 = BATTERY
BT1 = Battery: Multicell Battery; Published: 24-Mar-1999; LatestRevisionDate: 17-Jul-2002; LatestRevisionNote: Re-released for DXP Platform.; PackageReference: BAT-2; Publisher: Altium Limited
C1 C2 = Cap: 贴片电容; Value: 15pF; Published: 8-Jun-2000; LatestRevisionDate: 05-oct-2007  -  Semtech; LatestRevisionNote: Re-released for DXP Platform.; Publisher: Altium Limited
C3-C6 C92 C95 C96 C100-C102 = CAP: 贴片电容
C7 C23 C29 C30 C40-C48 C51-C63 C72 C75 C76 C79 C84 C97 C98 C107 C120 C127 C134 = C_0603: 贴片电容
  C47: Value: 1nF
  C48: Value: 100nF
C8 C12-C17 C20 C24 C26-C28 C31-C33 C39 C74 C80 C89 C94 C104 C105 C109 C112 C114-C117 C122 C128 C136 C140 = Cap: 贴片电容; Published: 8-Jun-2000; LatestRevisionNote: Re-released for DXP Platform.; Publisher: Altium Limited
  C8 C89: LatestRevisionDate: 17-Jul-2002; PackageReference: RAD-0.3; PackageDescription: Radial Cap, Thru-Hole; 2 Leads; 0.3 in Pin Spacing; Value: 1nF
  C12 C13: LatestRevisionDate: 17-Jul-2002; PackageReference: RAD-0.3; PackageDescription: Radial Cap, Thru-Hole; 2 Leads; 0.3 in Pin Spacing; Value: 12pF
  C14-C17 C31: LatestRevisionDate: 17-Jul-2002; PackageReference: RAD-0.3; PackageDescription: Radial Cap, Thru-Hole; 2 Leads; 0.3 in Pin Spacing; Value: 100nF
  C20 C28 C33 C39: LatestRevisionDate: 05-oct-2007  -  Semtech; Value: 1nF
  C24: LatestRevisionDate: 05-oct-2007  -  Semtech; Value: 10nF
  C26: LatestRevisionDate: 05-oct-2007  -  Semtech; Value: 100nF
  C27: LatestRevisionDate: 05-oct-2007  -  Semtech; Value: 47pF
  C32 C104 C105 C112 C114 C117 C122 C128 C136: LatestRevisionDate: 05-oct-2007  -  Semtech; Value: NC
  C74 C94: LatestRevisionDate: 05-oct-2007  -  Semtech; Value: 15pF
  C80: LatestRevisionDate: 17-Jul-2002; PackageReference: RAD-0.3; PackageDescription: Radial Cap, Thru-Hole; 2 Leads; 0.3 in Pin Spacing; Value: 10nF
  C109: LatestRevisionDate: 05-oct-2007  -  Semtech; Value: 22pF
  C115: LatestRevisionDate: 05-oct-2007  -  Semtech; Value: 10pF
  C116 C140: LatestRevisionDate: 05-oct-2007  -  Semtech; Value: 18pF
C9 = Cap: 贴片电容; Value: 3pF; Published: 8-Jun-2000; LatestRevisionDate: 05-oct-2007  -  Semtech; LatestRevisionNote: Re-released for DXP Platform.; Publisher: Altium Limited
C10 C73 C108 = Cap: 贴片电容; Value: 5pF; Published: 8-Jun-2000; LatestRevisionDate: 05-oct-2007  -  Semtech; LatestRevisionNote: Re-released for DXP Platform.; Publisher: Altium Limited
C11 C18 C25 C77 C81 C82 C86-C88 C121 C129 C135 C139 = Cap: 贴片电容; Value: 100pF; Published: 8-Jun-2000; LatestRevisionNote: Re-released for DXP Platform.; Publisher: Altium Limited
  C11 C18 C25 C81 C82 C87 C121 C129 C135 C139: LatestRevisionDate: 05-oct-2007  -  Semtech
  C77 C86 C88: LatestRevisionDate: 17-Jul-2002; PackageReference: RAD-0.3; PackageDescription: Radial Cap, Thru-Hole; 2 Leads; 0.3 in Pin Spacing
C19 C131 = Cap: 贴片电容; Value: 12pF/nop; Published: 8-Jun-2000; LatestRevisionDate: 05-oct-2007  -  Semtech; LatestRevisionNote: Re-released for DXP Platform.; Publisher: Altium Limited
C49 C50 = Cap Semi: 贴片电容; Value: 20pF; Published: 8-Jun-2000; LatestRevisionDate: 29-May-2009; LatestRevisionNote: IPC-7351 Footprint Added.; PackageReference: C1206; Publisher: Altium Limited; PackageDescription: Chip Capacitor
C64-C68 C71 C99 = Cap Semi: 贴片电容; Published: 8-Jun-2000; LatestRevisionDate: 29-May-2009; LatestRevisionNote: IPC-7351 Footprint Added.; PackageReference: C1206; Publisher: Altium Limited; PackageDescription: Chip Capacitor
  C64 C71 C99: Value: 100nF
  C65 C67 C68: Value: 12pF
  C66: Valie: 12pF
C69 = CAP: Capacitor
C70 = Cap Semi: 贴片电容; Value: 100nF; Published: 8-Jun-2000; LatestRevisionDate: 29-May-2009; LatestRevisionNote: IPC-7351 Footprint Added.; PackageReference: C1206; Publisher: Altium Limited; PackageDescription: Chip Capacitor
C78 = Cap: 贴片电容; Value: 1nF; Published: 8-Jun-2000; LatestRevisionDate: 17-Jul-2002; LatestRevisionNote: Re-released for DXP Platform.; PackageReference: RAD-0.3; Publisher: Altium Limited; PackageDescription: Radial Cap, Thru-Hole; 2 Leads; 0.3 in Pin Spacing
C83 C113 = Cap Pol1: 钽电容; Value: 470uF 6.3V; Published: 8-Jun-2000; LatestRevisionDate: 17-Jul-2002; LatestRevisionNote: Re-released for DXP Platform.; PackageReference: RB7.6-15; Publisher: Altium Limited; PackageDescription: Polarized Capacitor (Radial); 2 Leads
C85 C123 = Cap: 贴片电容; Value: 10nF; Published: 8-Jun-2000; LatestRevisionDate: 17-Jul-2002; LatestRevisionNote: Re-released for DXP Platform.; PackageReference: RAD-0.3; Publisher: Altium Limited; PackageDescription: Radial Cap, Thru-Hole; 2 Leads; 0.3 in Pin Spacing
C90 = Cap: 贴片电容; Value: 10pF; Published: 8-Jun-2000; LatestRevisionDate: 05-oct-2007  -  Semtech; LatestRevisionNote: Re-released for DXP Platform.; Publisher: Altium Limited
C91 = Cap: Capacitor; Value: 10nF; Published: 8-Jun-2000; LatestRevisionDate: 17-Jul-2002; LatestRevisionNote: Re-released for DXP Platform.; PackageReference: RAD-0.3; Publisher: Altium Limited; PackageDescription: Radial Cap, Thru-Hole; 2 Leads; 0.3 in Pin Spacing
C110 = Cap: 贴片电容; Value: 13pF; Published: 8-Jun-2000; LatestRevisionDate: 05-oct-2007  -  Semtech; LatestRevisionNote: Re-released for DXP Platform.; Publisher: Altium Limited
C111 = Cap: 贴片电容; Value: ?pF; Published: 8-Jun-2000; LatestRevisionDate: 05-oct-2007  -  Semtech; LatestRevisionNote: Re-released for DXP Platform.; Publisher: Altium Limited
C124 = Cap Pol1: 电解电容器; Published: 8-Jun-2000; LatestRevisionDate: 17-Jul-2002; LatestRevisionNote: Re-released for DXP Platform.; PackageReference: RB7.6-15; Publisher: Altium Limited; PackageDescription: Polarized Capacitor (Radial); 2 Leads; Value: 470uF 6.3V
C125 = Cap: 贴片电容; Value: 100p; Published: 8-Jun-2000; LatestRevisionDate: 05-oct-2007  -  Semtech; LatestRevisionNote: Re-released for DXP Platform.; Publisher: Altium Limited
C126 = Cap: 贴片电容; Value: 2.7nF; Published: 8-Jun-2000; LatestRevisionDate: 05-oct-2007  -  Semtech; LatestRevisionNote: Re-released for DXP Platform.; Publisher: Altium Limited
C130 = Cap: 贴片电容; Value: 8pF; Published: 8-Jun-2000; LatestRevisionDate: 05-oct-2007  -  Semtech; LatestRevisionNote: Re-released for DXP Platform.; Publisher: Altium Limited
C132 = Cap: Capacitor SMD; Value: 68pF; Published: 8-Jun-2000; LatestRevisionDate: 05-oct-2007  -  Semtech; LatestRevisionNote: Re-released for DXP Platform.; Publisher: Altium Limited
D1 D5 D6 = D Zener: Zener Diode; Published: 8-Jun-2000; LatestRevisionDate: 17-Jul-2002; LatestRevisionNote: Re-released for DXP Platform.; PackageReference: DIODE-0.7; Publisher: Altium Limited; PackageDescription: Diode, Thru-Hole; 2 Leads; 0.7 in Pin Spacing
D2-D4 = Diode 1N4149: 二极管; Published: 8-Jun-2000; LatestRevisionDate: 17-Jul-2002; LatestRevisionNote: Re-released for DXP Platform.; DatasheetVersion: 1989; PackageVersion: 1989; PackageReference: DO-35A; Publisher: Altium Limited; PackageDescription: Diode, Axial; Body 4.6 x 1.9 mm (LxDia. max), Lead Dia. 0.53 mm (max); Code_JEDEC: DO-204-AH; ComponentLink1Description: Manufacturer Link; ComponentLink1URL: http://www.national.com/
D7 = BA592: Silicon RF Switching Diode for VHF Band Switching in TV/VTR Tuners; Published: 21-Mar-2003; LatestRevisionDate: 19-Mar-2004; LatestRevisionNote: Silkscreen size reduced.; DatasheetDocument: Oct-1999; PackageDocument: Sep-2000; PackageReference: SOD-323; Publisher: Altium Limited; ComponentLink1Description: Manufacturer Link; ComponentLink1URL: http://www.infineon.com/; ComponentLink2Description: Datasheet; ComponentLink2URL: http://www.infineon.com/upload/Document/cmc_upload/documents/080/120/ba592_ba892series_1.pdf
L1-L3 L19 = Inductor: 贴片电感; Code_IEC: 1005; Published: 8-Jun-2000; Publisher: Altium Limited; Code_JEITA: 0402
  L1: LatestRevisionDate: 05-oct-2007  -  Semtech; LatestRevisionNote: Re-released for DXP Platform.; Value: 47nH
  L2: LatestRevisionDate: 05-oct-2007  -  Semtech; LatestRevisionNote: Re-released for DXP Platform.; Value: 22uH
  L3: LatestRevisionDate: 29-May-2009; LatestRevisionNote: IPC-7351 Footprint Added.; PackageReference: 0402-A; PackageDescription: Chip Inductor; Value: 4.7uH
  L19: LatestRevisionDate: 05-oct-2007  -  Semtech; LatestRevisionNote: Re-released for DXP Platform.
L4 L5 L20 = Inductor: 贴片电感; Code_IEC: 1005; Value: 33nH; Published: 8-Jun-2000; LatestRevisionDate: 05-oct-2007  -  Semtech; LatestRevisionNote: Re-released for DXP Platform.; Publisher: Altium Limited; Code_JEITA: 0402
L6 L9 L18 L26 = Inductor: 贴片电感; Code_IEC: 1005; Value: 68nH; Published: 8-Jun-2000; LatestRevisionDate: 05-oct-2007  -  Semtech; LatestRevisionNote: Re-released for DXP Platform.; Publisher: Altium Limited; Code_JEITA: 0402
L7 = Inductor: 贴片电感; Code_IEC: 1005; Value: 18nH; Published: 8-Jun-2000; LatestRevisionDate: 05-oct-2007  -  Semtech; LatestRevisionNote: Re-released for DXP Platform.; Publisher: Altium Limited; Code_JEITA: 0402
L8 L11 L25 L27 L28 = Inductor: 贴片电感; Code_IEC: 1005; Value: 6.8nH; Published: 8-Jun-2000; LatestRevisionDate: 05-oct-2007  -  Semtech; LatestRevisionNote: Re-released for DXP Platform.; Publisher: Altium Limited; Code_JEITA: 0402
L10 = Inductor: 贴片电感; Code_IEC: 1005; Value: 10nH; Published: 8-Jun-2000; LatestRevisionDate: 05-oct-2007  -  Semtech; LatestRevisionNote: Re-released for DXP Platform.; Publisher: Altium Limited; Code_JEITA: 0402
L14 = Inductor: 贴片电阻; Code_IEC: 1005; Value: 10nH; Published: 8-Jun-2000; LatestRevisionDate: 05-oct-2007  -  Semtech; LatestRevisionNote: Re-released for DXP Platform.; Publisher: Altium Limited; Code_JEITA: 0402
L15-L17 L21 L23 = Inductor: Code_IEC: 1005; Value: 100nH; Published: 8-Jun-2000; LatestRevisionDate: 29-May-2009; LatestRevisionNote: IPC-7351 Footprint Added.; PackageReference: 0402-A; Publisher: Altium Limited; PackageDescription: Chip Inductor; Code_JEITA: 0402
L24 = Inductor: 贴片电阻; Code_IEC: 1005; Value: 6.8nH; Published: 8-Jun-2000; LatestRevisionDate: 05-oct-2007  -  Semtech; LatestRevisionNote: Re-released for DXP Platform.; Publisher: Altium Limited; Code_JEITA: 0402
LD1 = LED: 红灯; pin to pad: 1>A 2>K
LD2 = LED: 绿灯; pin to pad: 1>A 2>K
LS1 = Speaker: Loudspeaker; Published: 24-Mar-1999; LatestRevisionDate: 17-Jul-2002; LatestRevisionNote: Re-released for DXP Platform.; PackageReference: PIN2; Publisher: Altium Limited
MK1 = Mic2: Microphone; Published: 24-Mar-1999; LatestRevisionDate: 17-Jul-2002; LatestRevisionNote: Re-released for DXP Platform.; PackageReference: PIN2; Publisher: Altium Limited
P3 = SMB: SMB Straight Connector; LatestRevisionDate: 17-Jul-2002; LatestRevisionNote: Re-released for DXP Platform.; Publisher: Altium Limited
P4 P10 = Header 2: Header, 2-Pin; LatestRevisionDate: 17-Jul-2002; LatestRevisionNote: Re-released for DXP Platform.; Publisher: Altium Limited
P5 = Header 8X2A: Header, 8-Pin, Dual row; LatestRevisionDate: 17-Jul-2002; LatestRevisionNote: Re-released for DXP Platform.; Publisher: Altium Limited
P6 P9 = Header 5: Header, 5-Pin; LatestRevisionDate: 17-Jul-2002; LatestRevisionNote: Re-released for DXP Platform.; Publisher: Altium Limited
P8 = Header 3: Header, 3-Pin; LatestRevisionDate: 17-Jul-2002; LatestRevisionNote: Re-released for DXP Platform.; Publisher: Altium Limited
Q1 Q10 = MOSFET-N: N-Channel MOSFET; pin to pad: 1>3 2>1 3>2; Published: 8-Jun-2000; LatestRevisionDate: 17-Jul-2002; LatestRevisionNote: Re-released for DXP Platform.; PackageVersion: 1995/1996; PackageReference: E3; Publisher: Altium Limited; PackageDescription: TO, Flat Index; 3 In-Line, Axial Leads; Body Dia. 4.6mm; Lead Dia. 0.5 mm (max)
Q2 Q8 = PMOS-2: P-Channel Power MOSFET; pin to pad: 2>3 3>2; Note: Pin 4 not drawn and electrically connected to Pin 2.; Published: 8-Jun-2000; LatestRevisionDate: 17-Jul-2002; LatestRevisionNote: Re-released for DXP Platform.; DatasheetVersion: PD-9.390D; PackageVersion: Feb-1997; PackageReference: TO-220AB; Publisher: Altium Limited; PackageDescription: TO, Thru-Hole, Vertical, Heatsink Mounted; 3 In-Line Leads; Pitch 2.54 mm; ComponentLink1Description: Manufacturer Link; ComponentLink1URL: http://www.irf.com/
Q3 = QNPN: NPN Bipolar Transistor; pin to pad: 1>3 2>1 3>2; Published: 8-Jun-2000; LatestRevisionDate: 29-May-2009; LatestRevisionNote: IPC-7351 Footprint Added.; PackageVersion: Aug-1999; PackageReference: SOT-23B; Publisher: Altium Limited; PackageDescription: 3-Pin SOT-23 Package 0.95 mm Pitch, 2.4 mm Lead Span
Q5 Q6 Q9 = PDTC114EEF: NPN Resistor-equipped Transistor; Published: 17-Sep-2003; DatasheetVersion: 31-May-1999; PackageVersion: Oct-1998; PackageReference: SOT490; Publisher: Altium Limited; PackageDescription: SC-89; 3 Flat Leads; Body 1.6 x 1.6 x 0.7 mm, inc leads (LxWxH typ); ComponentLink1Description: Manufacturer Link; ComponentLink1URL: http://www.semiconductors.philips.com/; ComponentLink2Description: Datasheet; ComponentLink2URL: http://www.semiconductors.philips.com/acrobat/datasheets/PDTC114E_SERIES_10.pdf
Q7 = NE3509: 三极管
R1 R11 R12 R28 = R_0603: 贴片电阻
R2 = Res2: 贴片电阻; Manufacturer: Generic Components; Class: Passive; SubClass: Resistor; Value: 2K; Published: 08/06/2000; Publisher: Altium Hobart Technology Centre
R3 = Resistor: 贴片电阻; Value: 20k; LatestRevisionDate: 27-Jul-20  -  Semtech
R4 = Resistor: 贴片电阻; Value: 2.7k; LatestRevisionDate: 27-Jul-20  -  Semtech
R5 R13 R45 = Res2: 贴片电阻; Value: 100K; Published: 8-Jun-2000; LatestRevisionDate: 17-Jul-2002; LatestRevisionNote: Re-released for DXP Platform.; PackageReference: AXIAL-0.4; Publisher: Altium Limited; PackageDescription: Axial Device, Thru-Hole; 2 Leads; 0.4 in Pin Spacing
R6 R27 = Resistor: 贴片电阻; Value: 1k; LatestRevisionDate: 27-Jul-20  -  Semtech
R7 R29 = Resistor: 贴片电阻; LatestRevisionDate: 27-Jul-20  -  Semtech
  R7: Value: 22R
  R29: Value: 0R
R8 = Resistor: 贴片电阻; Value: 11k; LatestRevisionDate: 27-Jul-20  -  Semtech
R9 = Res2: 贴片电阻; Value: 0R; Published: 8-Jun-2000; LatestRevisionDate: 17-Jul-2002; LatestRevisionNote: Re-released for DXP Platform.; PackageReference: AXIAL-0.4; Publisher: Altium Limited; PackageDescription: Axial Device, Thru-Hole; 2 Leads; 0.4 in Pin Spacing
R14-R16 R50 = RES: 贴片电阻
R18 = RES: 贴片电阻; Value: 10K
R19 R20 = RES: 贴片电阻; Value: 100K
R21 = RES: 贴片电阻; Value: 150
R22 R23 = Res2: 贴片电阻; Value: nop; Published: 8-Jun-2000; LatestRevisionDate: 17-Jul-2002; LatestRevisionNote: Re-released for DXP Platform.; PackageReference: AXIAL-0.4; Publisher: Altium Limited; PackageDescription: Axial Device, Thru-Hole; 2 Leads; 0.4 in Pin Spacing
R24 = RES: 贴片电阻; Value: 300
R25 = Res2: 贴片电阻; Value: 10k; Published: 8-Jun-2000; LatestRevisionDate: 17-Jul-2002; LatestRevisionNote: Re-released for DXP Platform.; PackageReference: AXIAL-0.4; Publisher: Altium Limited; PackageDescription: Axial Device, Thru-Hole; 2 Leads; 0.4 in Pin Spacing
R26 = Res2: 贴片电阻; Value: 10K; Published: 8-Jun-2000; LatestRevisionDate: 17-Jul-2002; LatestRevisionNote: Re-released for DXP Platform.; PackageReference: AXIAL-0.4; Publisher: Altium Limited; PackageDescription: Axial Device, Thru-Hole; 2 Leads; 0.4 in Pin Spacing
R32 R35 R47 = Resistor: 贴片电阻; Value: 10KΩ; LatestRevisionDate: 27-Jul-20  -  Semtech
R46 = Resistor: 贴片电阻; Value: 0R; LatestRevisionDate: 27-Jul-20  -  Semtech
R48 = Resistor: 贴片电阻; Value: 3.9k; LatestRevisionDate: 27-Jul-20  -  Semtech
R49 = Resistor: 贴片电阻; Value: 3.3k; LatestRevisionDate: 27-Jul-20  -  Semtech
R51 = Resistor: 贴片电阻; Value: 68R; LatestRevisionDate: 27-Jul-20  -  Semtech
R52 = Res1: 贴片电阻; Published: 8-Jun-2000; LatestRevisionDate: 17-Jul-2002; LatestRevisionNote: Re-released for DXP Platform.; PackageReference: AXIAL-0.3; Publisher: Altium Limited; PackageDescription: Axial Device, Thru-Hole; 2 Leads; 0.3 in Pin Spacing; Value: 56R
S1 S2 = SW-PB: Switch; Published: 24-Mar-1999; LatestRevisionDate: 17-Jul-2002; LatestRevisionNote: Re-released for DXP Platform.; PackageReference: SPST-2; Publisher: Altium Limited; PackageDescription: Switch; 2 Leads
U1 = RT9193
U4 = SX1276: SX1276 - Low Power Integrated UHF Transceiver with loRa Modem; LatestRevisionDate: 27-Jul-2009 -  Semtech
U5 U7 = PE4259 RF Switch: PE4259 Peregrine RF Switch; LatestRevisionDate: 03-Sep-2012 -  Semtech; Value: PE4259
U8 = RDA846S
U10 = STM32F405RGT6: ARM Cortex-M4 32b MCU+FPU, 210DMIP, 1024 kB Flash, 192+4 kB RAM, 51 I/Os, 64-pin LQFP, -40 to +85癈, Tray; Internal RAM: 192kB; Operating Frequency (Processor Speed): 168MHz; A/D Converter: 16x12-bit; D/A Converter: 2x12-bit; 16-bit Timers (IC/OC/PWM): 12x16-bit(24/24/30); 32-bit Timer (IC/OC/PWM): 2x32-bit (8/8/8); Other Timer Functions: 2xWDG, RTC, 24-bit down counter; Serial Interface: 3xSPI/2xI2S/2xI2C/3xUSART(IrDa, ISO7816)/3xUART/1xUSB OTG FS/HS, 2xCAN/ SDIO; DatasheetVersion: rev2, Jan-2012; PackageVersion: 2012; PackageReference: TQFP64; PackageDescription: 64-Pin Low Profile Quad Flat Package, 10x10 mm Body, 0.5 mm Pitch; ComponentLink1Description: Manufacturer URL; ComponentLink1URL: http://www.st.com/; ComponentLink2Description: STM32F405/7 Datasheet; ComponentLink2URL: http://www.st.com/internet/com/TECHNICAL_RESOURCES/TECHNICAL_LITERATURE/DATASHEET/DM00037051.pdf; ComponentLink3Description: STM32F4 Web Page; ComponentLink3URL: http://www.st.com/internet/mcu/subclass/1521.jsp
U12 = Component_1: 反相器
Y1-Y3 = XTAL: Crystal Oscillator; pin to pad: 2>3; Published: 8-Jun-2000; LatestRevisionDate: 17-Jul-2002; LatestRevisionNote: Re-released for DXP Platform.; PackageReference: R38; Publisher: Altium Limited; PackageDescription: Crystal, Thru-Hole; 2 Leads; Body 3.1 x 8.2 mm (Dia.xH)
  Y1: Value: 32Mhz
  Y2: Value: 13MHz
  Y3: Value: 8MHz
Y4 = XTAL: Crystal Oscillator; Published: 8-Jun-2000; LatestRevisionDate: 17-Jul-2002; LatestRevisionNote: Re-released for DXP Platform.; PackageReference: R38; Publisher: Altium Limited; PackageDescription: Crystal, Thru-Hole; 2 Leads; Body 3.1 x 8.2 mm (Dia.xH); Value: 32.768KHz